# Altium schematic sheet [03] - DIMM CON.SchDoc: IMXBB
size A3; DocumentNumber: 3; Revision: 2.0; SheetNumber: 3; SheetTotal: 13
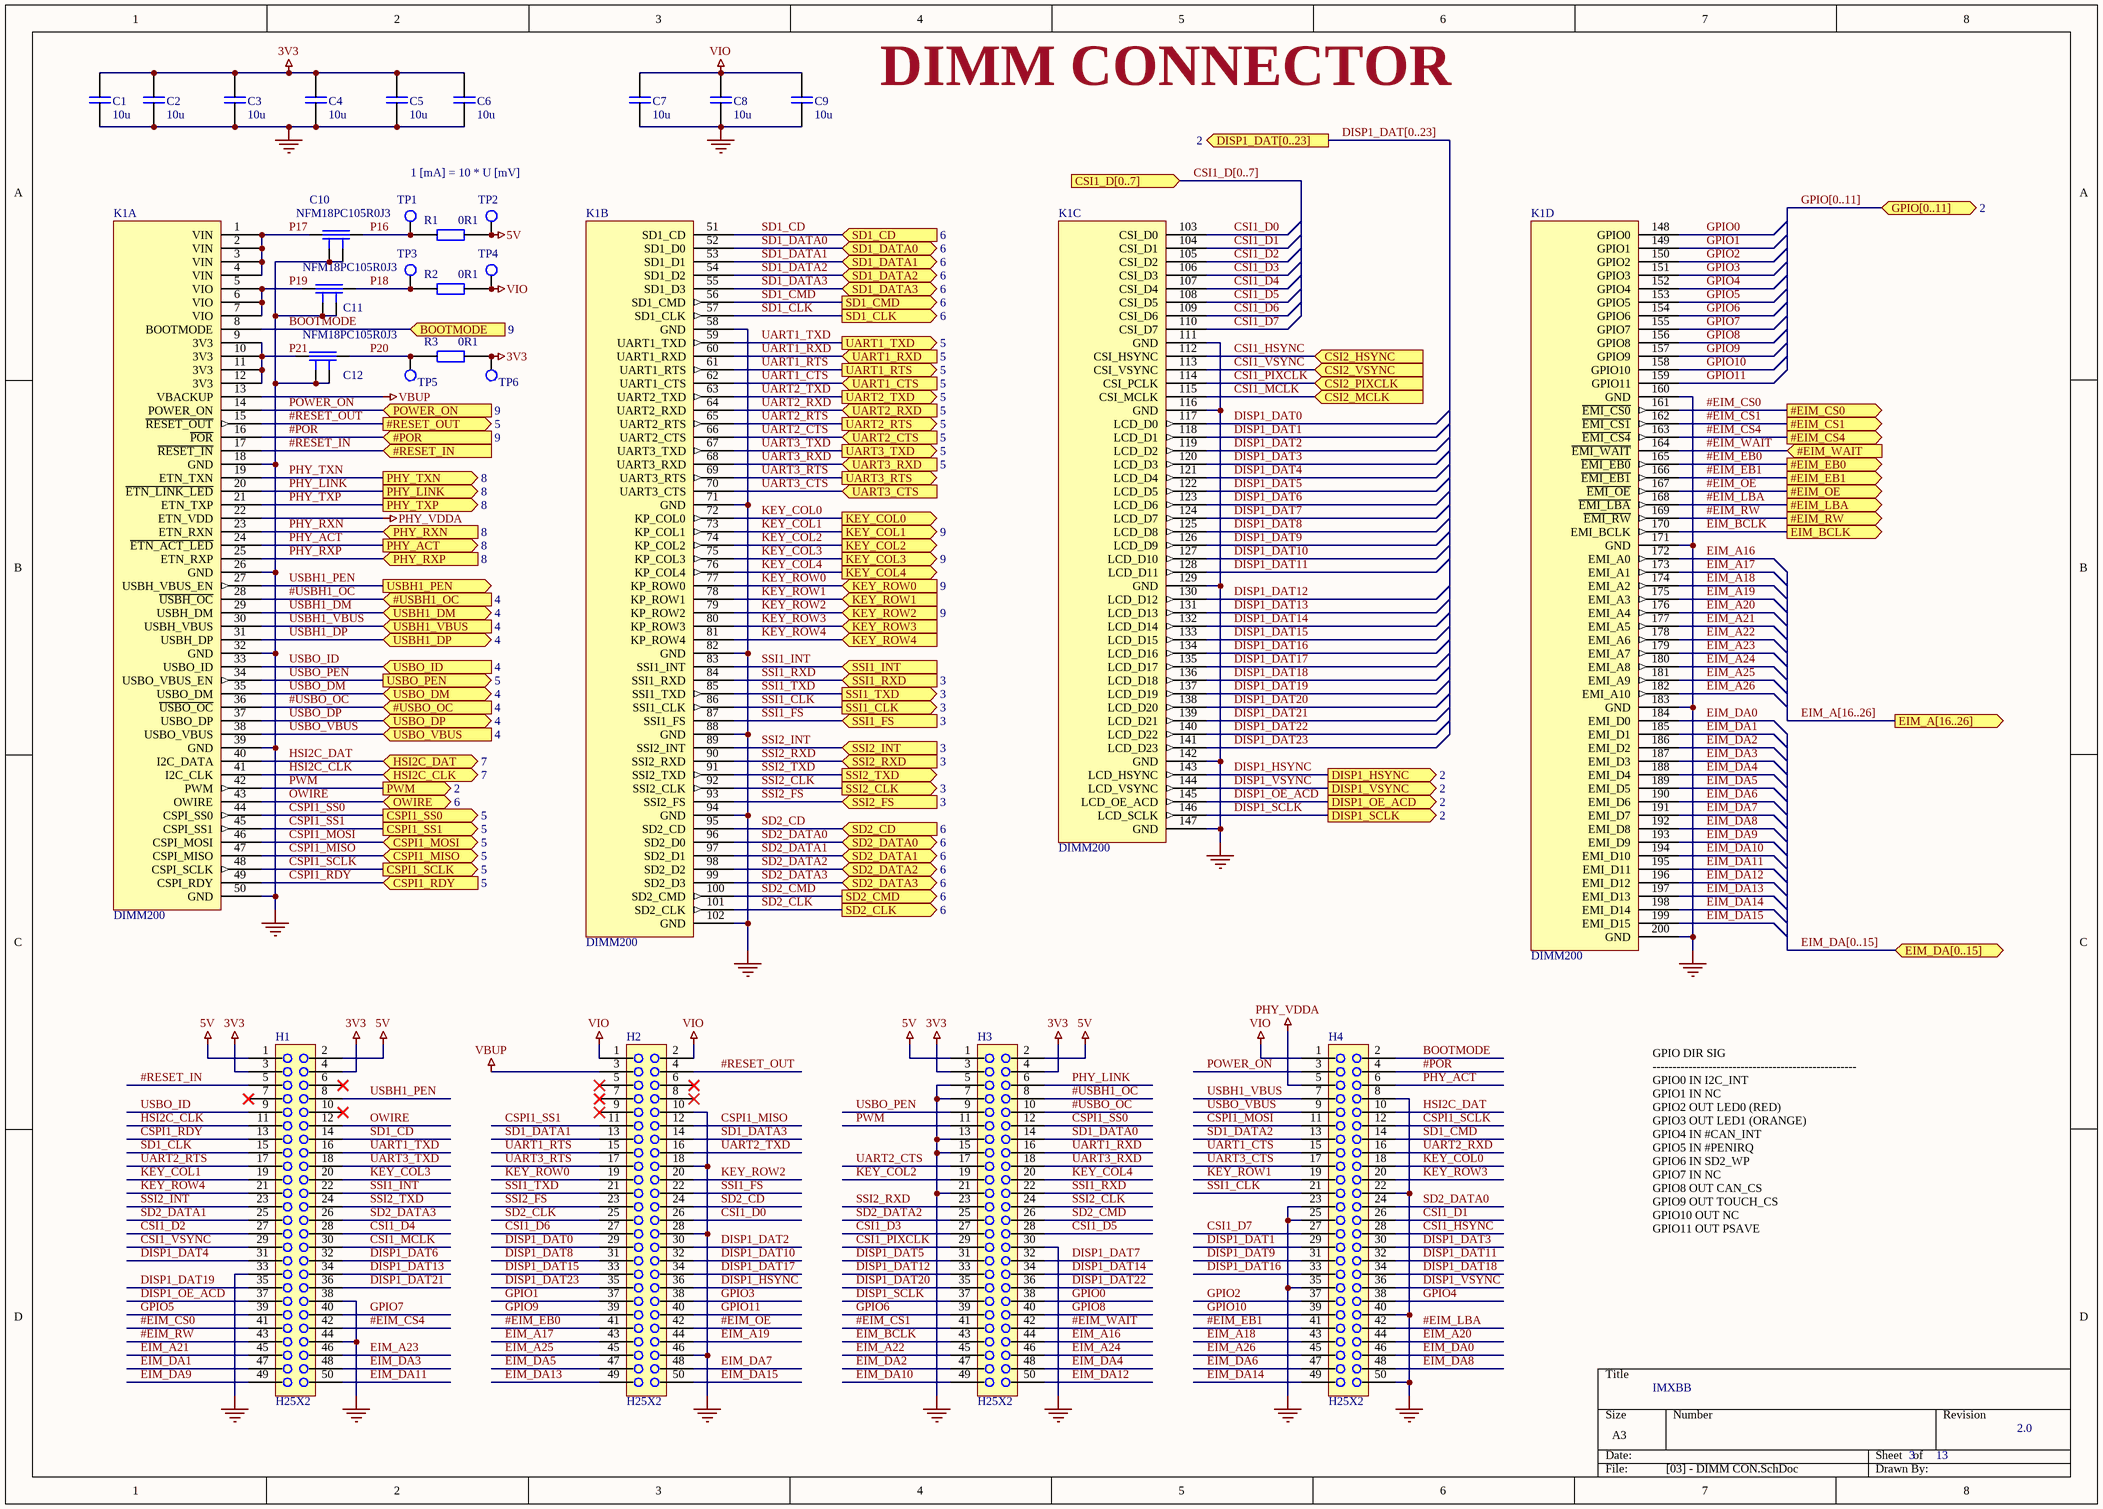
[diagram p0: [03] - DIMM CON.SchDoc]

## Parts
C1  10u  [0805]
C2  10u  [0805]
C3  10u  [0805]
C4  10u  [0805]
C5  10u  [0805]
C6  10u  [0805]
C7  10u  [0805]
C8  10u  [0805]
C9  10u  [0805]
C10  NFM18PC105R0J3  [NFM18P]
C11  NFM18PC105R0J3  [NFM18P]
C12  NFM18PC105R0J3  [NFM18P]
H1  H25X2  [H2x25]
H2  H25X2  [H2x25]
H3  H25X2  [H2x25]
H4  H25X2  [H2x25]
K1  DIMM200  [SODIMM200EDGE]  (parts A,B,C,D of 4)
R1  0R1  [0603]
R2  0R1  [0603]
R3  0R1  [0603]
TP1  TESTPOINT  [TESTPOINT_2mm]  (value not drawn)
TP2  TESTPOINT  [TESTPOINT_2mm]  (value not drawn)
TP3  TESTPOINT  [TESTPOINT_2mm]  (value not drawn)
TP4  TESTPOINT  [TESTPOINT_2mm]  (value not drawn)
TP5  TESTPOINT  [TESTPOINT_2mm]  (value not drawn)
TP6  TESTPOINT  [TESTPOINT_2mm]  (value not drawn)

## Ports
#EIM_CS0 (out), #EIM_CS1 (out), #EIM_CS4 (out), #EIM_EB0 (out), #EIM_EB1 (out), #EIM_LBA (out), #EIM_OE (out), #EIM_RW (out), #EIM_WAIT (in), #POR (in, see 9), #RESET_IN (in), #RESET_OUT (out, see 5), #USBH1_OC (in, see 4), #USBO_OC (in, see 4), BOOTMODE (in, see 9), CSI1_D[0..7] (in), CSI2_HSYNC (in), CSI2_MCLK (in), CSI2_PIXCLK (in), CSI2_VSYNC (in), CSPI1_MISO (bidir, see 5), CSPI1_MOSI (bidir, see 5), CSPI1_RDY (in, see 5), CSPI1_SCLK (out, see 5), CSPI1_SS0 (out, see 5), CSPI1_SS1 (out, see 5), DISP1_DAT[0..23] (out, see 2), DISP1_HSYNC (out, see 2), DISP1_OE_ACD (out, see 2), DISP1_SCLK (out, see 2), DISP1_VSYNC (out, see 2), EIM_A[16..26] (out), EIM_BCLK (out), EIM_DA[0..15] (bidir), GPIO[0..11] (bidir, see 2), HSI2C_CLK (bidir, see 7), HSI2C_DAT (bidir, see 7), KEY_COL0 (out), KEY_COL1 (out, see 9), KEY_COL2 (out), KEY_COL3 (out, see 9), KEY_COL4 (out), KEY_ROW0 (in, see 9), KEY_ROW1 (in), KEY_ROW2 (in, see 9), KEY_ROW3 (in), KEY_ROW4 (in), OWIRE (bidir, see 6), PHY_ACT (out, see 8), PHY_LINK (out, see 8), PHY_RXN (in, see 8), PHY_RXP (in, see 8), PHY_TXN (out, see 8), PHY_TXP (out, see 8), POWER_ON (in, see 9), PWM (out, see 2), SD1_CD (in, see 6), SD1_CLK (out, see 6), SD1_CMD (out, see 6), SD1_DATA0 (bidir, see 6), SD1_DATA1 (bidir, see 6), SD1_DATA2 (bidir, see 6), SD1_DATA3 (bidir, see 6), SD2_CD (in, see 6), SD2_CLK (out, see 6), SD2_CMD (out, see 6), SD2_DATA0 (bidir, see 6), SD2_DATA1 (bidir, see 6), SD2_DATA2 (bidir, see 6), SD2_DATA3 (bidir, see 6), SSI1_CLK (out, see 3), SSI1_FS (in, see 3), SSI1_INT (in), SSI1_RXD (in, see 3), SSI1_TXD (out, see 3), SSI2_CLK (out, see 3), SSI2_FS (in, see 3), SSI2_INT (in, see 3), SSI2_RXD (in, see 3), SSI2_TXD (out), UART1_CTS (in, see 5), UART1_RTS (out, see 5), UART1_RXD (in, see 5), UART1_TXD (out, see 5), UART2_CTS (in, see 5), UART2_RTS (out, see 5), UART2_RXD (in, see 5), UART2_TXD (out, see 5), UART3_CTS (in), UART3_RTS (out), UART3_RXD (in, see 5), UART3_TXD (out, see 5), USBH1_DM (bidir, see 4), USBH1_DP (bidir, see 4), USBH1_PEN (out), USBH1_VBUS (in, see 4), USBO_DM (bidir, see 4), USBO_DP (bidir, see 4), USBO_ID (in, see 4), USBO_PEN (out, see 5), USBO_VBUS (in, see 4)

## Nets
3V3: C1.2 C2.2 C3.2 C4.2 C5.2 C6.2 H1.3 H1.4 H3.3 H3.4 R3.2 TP6.1
5V: H1.1 H1.2 H3.1 H3.2 R1.2 TP2.1
GND: C1.1 C2.1 C3.1 C4.1 C5.1 C6.1 C7.1 C8.1 C9.1 C10.2 C10.4 C11.2 C11.4 C12.2 C12.4 H1.33 H1.38 H1.44 H2.10 H2.18 H2.28 H2.46 H3.5 H3.7 H3.13 H3.15 H3.21 H3.30 H4.8 H4.22 H4.23 H4.25 H4.35 H4.40 H4.50 K1.18(GND) K1.26(GND) K1.32(GND) K1.39(GND) K1.50(GND) K1.58(GND) K1.71(GND) K1.82(GND) K1.88(GND) K1.94(GND) K1.102(GND) K1.111(GND) K1.116(GND) K1.129(GND) K1.142(GND) K1.147(GND) K1.160(GND) K1.171(GND) K1.183(GND) K1.200(GND)
PHY_VDDA: H4.5 K1.22(ETN_VDD)
VBUP: H2.3 K1.13(VBACKUP)
VIO: C7.2 C8.2 C9.2 H2.1 H2.2 H4.1 R2.2 TP4.1
#EIM_CS0: H1.41 K1.161(~{EMI_CS0}) ; port #EIM_CS0
#EIM_CS1: H3.41 K1.162(~{EMI_CS1}) ; port #EIM_CS1
#EIM_CS4: H1.42 K1.163(~{EMI_CS4}) ; port #EIM_CS4
#EIM_EB0: H2.41 K1.165(~{EMI_EB0}) ; port #EIM_EB0
#EIM_EB1: H4.41 K1.166(~{EMI_EB1}) ; port #EIM_EB1
#EIM_LBA: H4.42 K1.168(~{EMI_LBA}) ; port #EIM_LBA
#EIM_OE: H2.42 K1.167(~{EMI_OE}) ; port #EIM_OE
#EIM_RW: H1.43 K1.169(~{EMI_RW}) ; port #EIM_RW
#EIM_WAIT: H3.42 K1.164(~{EMI_WAIT}) ; port #EIM_WAIT
#POR: H4.4 K1.16(~{POR}) ; port #POR
#RESET_IN: H1.5 K1.17(~{RESET_IN}) ; port #RESET_IN
#RESET_OUT: H2.4 K1.15(~{RESET_OUT}) ; port #RESET_OUT
#USBH1_OC: H3.8 K1.28(~{USBH_OC}) ; port #USBH1_OC
#USBO_OC: H3.10 K1.36(~{USBO_OC}) ; port #USBO_OC
BOOTMODE: H4.2 K1.8(BOOTMODE) ; port BOOTMODE
CSI1_D0: H2.26 K1.103(CSI_D0)
CSI1_D1: H4.26 K1.104(CSI_D1)
CSI1_D2: H1.27 K1.105(CSI_D2)
CSI1_D3: H3.27 K1.106(CSI_D3)
CSI1_D4: H1.28 K1.107(CSI_D4)
CSI1_D5: H3.28 K1.108(CSI_D5)
CSI1_D6: H2.27 K1.109(CSI_D6)
CSI1_D7: H4.27 K1.110(CSI_D7)
CSI1_HSYNC: H4.28 K1.112(CSI_HSYNC) ; port CSI2_HSYNC
CSI1_MCLK: H1.30 K1.115(CSI_MCLK) ; port CSI2_MCLK
CSI1_PIXCLK: H3.29 K1.114(CSI_PCLK) ; port CSI2_PIXCLK
CSI1_VSYNC: H1.29 K1.113(CSI_VSYNC) ; port CSI2_VSYNC
CSPI1_MISO: H2.12 K1.47(CSPI_MISO) ; port CSPI1_MISO
CSPI1_MOSI: H4.11 K1.46(CSPI_MOSI) ; port CSPI1_MOSI
CSPI1_RDY: H1.13 K1.49(CSPI_RDY) ; port CSPI1_RDY
CSPI1_SCLK: H4.12 K1.48(CSPI_SCLK) ; port CSPI1_SCLK
CSPI1_SS0: H3.12 K1.44(CSPI_SS0) ; port CSPI1_SS0
CSPI1_SS1: H2.11 K1.45(CSPI_SS1) ; port CSPI1_SS1
DISP1_DAT0: H2.29 K1.117(LCD_D0)
DISP1_DAT1: H4.29 K1.118(LCD_D1)
DISP1_DAT2: H2.30 K1.119(LCD_D2)
DISP1_DAT3: H4.30 K1.120(LCD_D3)
DISP1_DAT4: H1.31 K1.121(LCD_D4)
DISP1_DAT5: H3.31 K1.122(LCD_D5)
DISP1_DAT6: H1.32 K1.123(LCD_D6)
DISP1_DAT7: H3.32 K1.124(LCD_D7)
DISP1_DAT8: H2.31 K1.125(LCD_D8)
DISP1_DAT9: H4.31 K1.126(LCD_D9)
DISP1_DAT10: H2.32 K1.127(LCD_D10)
DISP1_DAT11: H4.32 K1.128(LCD_D11)
DISP1_DAT12: H3.33 K1.130(LCD_D12)
DISP1_DAT13: H1.34 K1.131(LCD_D13)
DISP1_DAT14: H3.34 K1.132(LCD_D14)
DISP1_DAT15: H2.33 K1.133(LCD_D15)
DISP1_DAT16: H4.33 K1.134(LCD_D16)
DISP1_DAT17: H2.34 K1.135(LCD_D17)
DISP1_DAT18: H4.34 K1.136(LCD_D18)
DISP1_DAT19: H1.35 K1.137(LCD_D19)
DISP1_DAT20: H3.35 K1.138(LCD_D20)
DISP1_DAT21: H1.36 K1.139(LCD_D21)
DISP1_DAT22: H3.36 K1.140(LCD_D22)
DISP1_DAT23: H2.35 K1.141(LCD_D23)
DISP1_HSYNC: H2.36 K1.143(LCD_HSYNC) ; port DISP1_HSYNC
DISP1_OE_ACD: H1.37 K1.145(LCD_OE_ACD) ; port DISP1_OE_ACD
DISP1_SCLK: H3.37 K1.146(LCD_SCLK) ; port DISP1_SCLK
DISP1_VSYNC: H4.36 K1.144(LCD_VSYNC) ; port DISP1_VSYNC
EIM_A16: H3.44 K1.172(EMI_A0)
EIM_A17: H2.43 K1.173(EMI_A1)
EIM_A18: H4.43 K1.174(EMI_A2)
EIM_A19: H2.44 K1.175(EMI_A3)
EIM_A20: H4.44 K1.176(EMI_A4)
EIM_A21: H1.45 K1.177(EMI_A5)
EIM_A22: H3.45 K1.178(EMI_A6)
EIM_A23: H1.46 K1.179(EMI_A7)
EIM_A24: H3.46 K1.180(EMI_A8)
EIM_A25: H2.45 K1.181(EMI_A9)
EIM_A26: H4.45 K1.182(EMI_A10)
EIM_BCLK: H3.43 K1.170(EMI_BCLK) ; port EIM_BCLK
EIM_DA0: H4.46 K1.184(EMI_D0)
EIM_DA1: H1.47 K1.185(EMI_D1)
EIM_DA2: H3.47 K1.186(EMI_D2)
EIM_DA3: H1.48 K1.187(EMI_D3)
EIM_DA4: H3.48 K1.188(EMI_D4)
EIM_DA5: H2.47 K1.189(EMI_D5)
EIM_DA6: H4.47 K1.190(EMI_D6)
EIM_DA7: H2.48 K1.191(EMI_D7)
EIM_DA8: H4.48 K1.192(EMI_D8)
EIM_DA9: H1.49 K1.193(EMI_D9)
EIM_DA10: H3.49 K1.194(EMI_D10)
EIM_DA11: H1.50 K1.195(EMI_D11)
EIM_DA12: H3.50 K1.196(EMI_D12)
EIM_DA13: H2.49 K1.197(EMI_D13)
EIM_DA14: H4.49 K1.198(EMI_D14)
EIM_DA15: H2.50 K1.199(EMI_D15)
GPIO0: H3.38 K1.148(GPIO0)
GPIO1: H2.37 K1.149(GPIO1)
GPIO2: H4.37 K1.150(GPIO2)
GPIO3: H2.38 K1.151(GPIO3)
GPIO4: H4.38 K1.152(GPIO4)
GPIO5: H1.39 K1.153(GPIO5)
GPIO6: H3.39 K1.154(GPIO6)
GPIO7: H1.40 K1.155(GPIO7)
GPIO8: H3.40 K1.156(GPIO8)
GPIO9: H2.39 K1.157(GPIO9)
GPIO10: H4.39 K1.158(GPIO10)
GPIO11: H2.40 K1.159(GPIO11)
HSI2C_CLK: H1.11 K1.41(I2C_CLK) ; port HSI2C_CLK
HSI2C_DAT: H4.10 K1.40(I2C_DATA) ; port HSI2C_DAT
KEY_COL0: H4.18 K1.72(KP_COL0) ; port KEY_COL0
KEY_COL1: H1.19 K1.73(KP_COL1) ; port KEY_COL1
KEY_COL2: H3.19 K1.74(KP_COL2) ; port KEY_COL2
KEY_COL3: H1.20 K1.75(KP_COL3) ; port KEY_COL3
KEY_COL4: H3.20 K1.76(KP_COL4) ; port KEY_COL4
KEY_ROW0: H2.19 K1.77(KP_ROW0) ; port KEY_ROW0
KEY_ROW1: H4.19 K1.78(KP_ROW1) ; port KEY_ROW1
KEY_ROW2: H2.20 K1.79(KP_ROW2) ; port KEY_ROW2
KEY_ROW3: H4.20 K1.80(KP_ROW3) ; port KEY_ROW3
KEY_ROW4: H1.21 K1.81(KP_ROW4) ; port KEY_ROW4
OWIRE: H1.12 K1.43(OWIRE) ; port OWIRE
P16: C10.3 R1.1 TP1.1
P17: C10.1 K1.1(VIN) K1.2(VIN) K1.3(VIN) K1.4(VIN)
P18: C11.3 R2.1 TP3.1
P19: C11.1 K1.5(VIO) K1.6(VIO) K1.7(VIO)
P20: C12.3 R3.1 TP5.1
P21: C12.1 K1.9(3V3) K1.10(3V3) K1.11(3V3) K1.12(3V3)
PHY_ACT: H4.6 K1.24(~{ETN_ACT_LED}) ; port PHY_ACT
PHY_LINK: H3.6 K1.20(~{ETN_LINK_LED}) ; port PHY_LINK
PHY_RXN: K1.23(ETN_RXN) ; port PHY_RXN
PHY_RXP: K1.25(ETN_RXP) ; port PHY_RXP
PHY_TXN: K1.19(ETN_TXN) ; port PHY_TXN
PHY_TXP: K1.21(ETN_TXP) ; port PHY_TXP
POWER_ON: H4.3 K1.14(POWER_ON) ; port POWER_ON
PWM: H3.11 K1.42(PWM) ; port PWM
SD1_CD: H1.14 K1.51(SD1_CD) ; port SD1_CD
SD1_CLK: H1.15 K1.57(SD1_CLK) ; port SD1_CLK
SD1_CMD: H4.14 K1.56(SD1_CMD) ; port SD1_CMD
SD1_DATA0: H3.14 K1.52(SD1_D0) ; port SD1_DATA0
SD1_DATA1: H2.13 K1.53(SD1_D1) ; port SD1_DATA1
SD1_DATA2: H4.13 K1.54(SD1_D2) ; port SD1_DATA2
SD1_DATA3: H2.14 K1.55(SD1_D3) ; port SD1_DATA3
SD2_CD: H2.24 K1.95(SD2_CD) ; port SD2_CD
SD2_CLK: H2.25 K1.101(SD2_CLK) ; port SD2_CLK
SD2_CMD: H3.26 K1.100(SD2_CMD) ; port SD2_CMD
SD2_DATA0: H4.24 K1.96(SD2_D0) ; port SD2_DATA0
SD2_DATA1: H1.25 K1.97(SD2_D1) ; port SD2_DATA1
SD2_DATA2: H3.25 K1.98(SD2_D2) ; port SD2_DATA2
SD2_DATA3: H1.26 K1.99(SD2_D3) ; port SD2_DATA3
SSI1_CLK: H4.21 K1.86(SSI1_CLK) ; port SSI1_CLK
SSI1_FS: H2.22 K1.87(SSI1_FS) ; port SSI1_FS
SSI1_INT: H1.22 K1.83(SSI1_INT) ; port SSI1_INT
SSI1_RXD: H3.22 K1.84(SSI1_RXD) ; port SSI1_RXD
SSI1_TXD: H2.21 K1.85(SSI1_TXD) ; port SSI1_TXD
SSI2_CLK: H3.24 K1.92(SSI2_CLK) ; port SSI2_CLK
SSI2_FS: H2.23 K1.93(SSI2_FS) ; port SSI2_FS
SSI2_INT: H1.23 K1.89(SSI2_INT) ; port SSI2_INT
SSI2_RXD: H3.23 K1.90(SSI2_RXD) ; port SSI2_RXD
SSI2_TXD: H1.24 K1.91(SSI2_TXD) ; port SSI2_TXD
UART1_CTS: H4.15 K1.62(UART1_CTS) ; port UART1_CTS
UART1_RTS: H2.15 K1.61(UART1_RTS) ; port UART1_RTS
UART1_RXD: H3.16 K1.60(UART1_RXD) ; port UART1_RXD
UART1_TXD: H1.16 K1.59(UART1_TXD) ; port UART1_TXD
UART2_CTS: H3.17 K1.66(UART2_CTS) ; port UART2_CTS
UART2_RTS: H1.17 K1.65(UART2_RTS) ; port UART2_RTS
UART2_RXD: H4.16 K1.64(UART2_RXD) ; port UART2_RXD
UART2_TXD: H2.16 K1.63(UART2_TXD) ; port UART2_TXD
UART3_CTS: H4.17 K1.70(UART3_CTS) ; port UART3_CTS
UART3_RTS: H2.17 K1.69(UART3_RTS) ; port UART3_RTS
UART3_RXD: H3.18 K1.68(UART3_RXD) ; port UART3_RXD
UART3_TXD: H1.18 K1.67(UART3_TXD) ; port UART3_TXD
USBH1_DM: K1.29(USBH_DM) ; port USBH1_DM
USBH1_DP: K1.31(USBH_DP) ; port USBH1_DP
USBH1_PEN: H1.8 K1.27(USBH_VBUS_EN) ; port USBH1_PEN
USBH1_VBUS: H4.7 K1.30(USBH_VBUS) ; port USBH1_VBUS
USBO_DM: K1.35(USBO_DM) ; port USBO_DM
USBO_DP: K1.37(USBO_DP) ; port USBO_DP
USBO_ID: H1.9 K1.33(USBO_ID) ; port USBO_ID
USBO_PEN: H3.9 K1.34(USBO_VBUS_EN) ; port USBO_PEN
USBO_VBUS: H4.9 K1.38(USBO_VBUS) ; port USBO_VBUS

Not connected (* = marked no-connect by the designer): H1 6* 7* 10*; H2 5* 6* 7* 8* 9*

## Buses and harness runs
bus CSI1_D[0..7] = port CSI1_D[0..7]
bus DISP1_DAT[0..23] = port DISP1_DAT[0..23]
bus EIM_A[16..26] = port EIM_A[16..26]
bus EIM_DA[0..15] = port EIM_DA[0..15]
bus GPIO[0..11] = port GPIO[0..11]

## Notes on the sheet
- DIMM CONNECTOR
- 1 [mA] = 10 * U [mV]
- GPIO	DIR	SIG
  ---------------------------------------------------
  GPIO0	IN	I2C_INT
  GPIO1	IN	NC
  GPIO2	OUT	LED0 (RED)
  GPIO3	OUT	LED1 (ORANGE)
  GPIO4	IN	#CAN_INT
  GPIO5	IN	#PENIRQ
  GPIO6	IN	SD2_WP
  GPIO7	IN	NC
  GPIO8	OUT	CAN_CS
  GPIO9	OUT	TOUCH_CS
  GPIO10	OUT	NC
  GPIO11	OUT	PSAVE

## Library data of the parts
C1-C9 = C
C10-C12 = NFL21S: Chip EMIFIL; Producer: Murata; Order number: NFM18PC105R0J3; Component class: C; Assembly type: SMT
R1-R3 = R
TP1-TP6 = TESTPOINT: Testpoint pad; Order number: no component; Component class: TP; Producer: n/a; Assembly type: no component